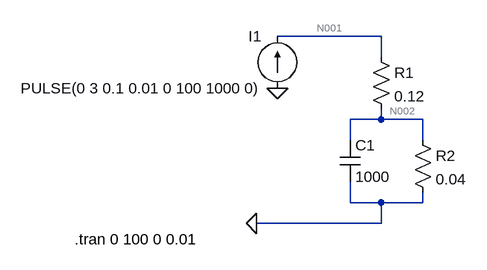
[diagram p0: schematic DRAFT2.asc]
DRAFT2.asc, the LTspice schematic file:
Version 4
SHEET 1 880 680
WIRE 192 32 32 32
WIRE 192 64 192 32
WIRE 192 160 192 144
WIRE 192 160 144 160
WIRE 256 160 192 160
WIRE 144 192 144 160
WIRE 256 192 256 160
WIRE 144 288 144 256
WIRE 192 288 144 288
WIRE 256 288 256 272
WIRE 256 288 192 288
WIRE 192 320 192 288
WIRE 192 320 0 320
FLAG 0 320 0
FLAG 32 112 0
SYMBOL res 176 48 R0
SYMATTR InstName R1
SYMATTR Value 0.12
SYMBOL res 240 176 R0
SYMATTR InstName R2
SYMATTR Value 0.04
SYMBOL cap 128 192 R0
SYMATTR InstName C1
SYMATTR Value 1000
SYMBOL current 32 112 R180
WINDOW 0 24 80 Left 2
WINDOW 3 24 0 Left 2
WINDOW 123 0 0 Left 0
WINDOW 39 0 0 Left 0
SYMATTR InstName I1
SYMATTR Value PULSE(0 3 0.1 0.01 0 100 1000 0)
TEXT -280 344 Left 2 !.tran 0 100 0 0.01

The netlist it stands for:
* DRAFT2.asc
R1 N001 N002 0.12
R2 N002 0 0.04
C1 N002 0 1000
I1 0 N001 PULSE(0 3 0.1 0.01 0 100 1000 0)
.tran 0 100 0 0.01
.backanno
.end

* Results of the author's LTspice run, read from the files saved beside the schematic
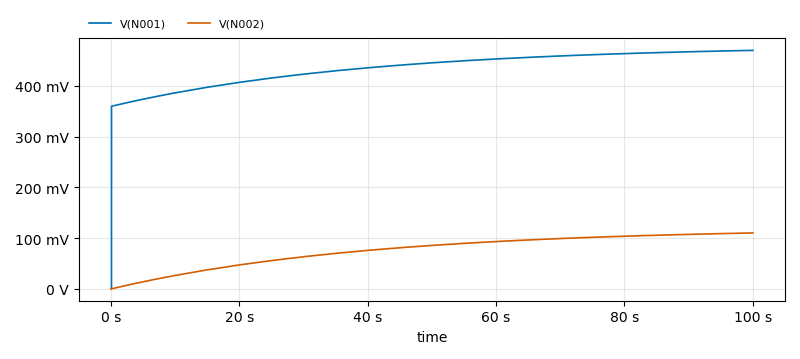
[diagram p1: Transient Analysis of DRAFT2.asc, plotted from the saved traces]
* Transient Analysis, 1 run:
*   V(N001): min 0 V, max 470.1 mV, average 435.4 mV, rms 436.7 mV, last 470.1 mV
*   V(N002): min 0 V, max 110.1 mV, average 75.77 mV, rms 81.69 mV, last 110.1 mV